# EAGLE design power_ldo (EAGLE 9.0.1)
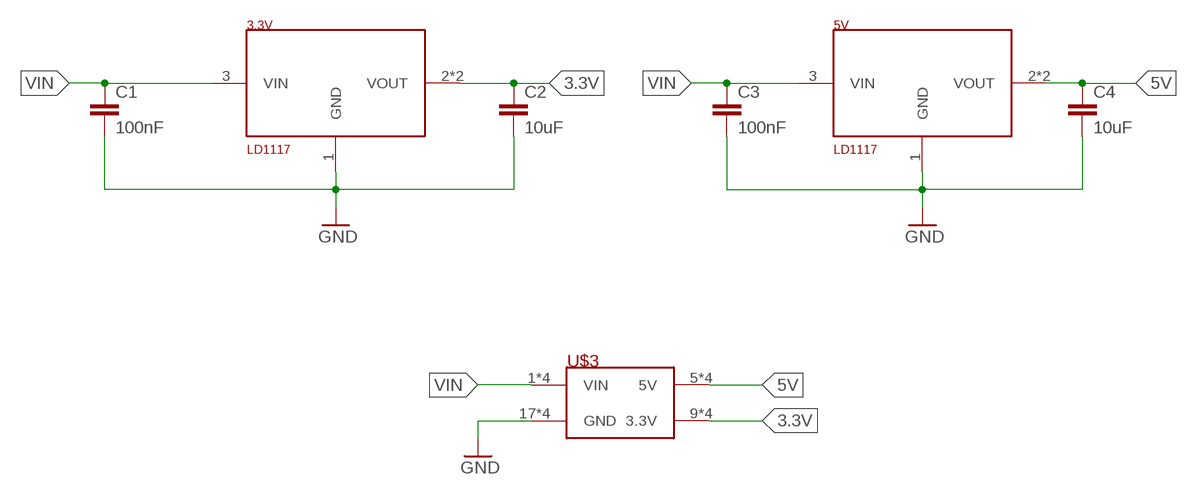
[diagram p0: schematic, sheet 1]

## Parts
3.3V  LD1117"  [SOT223]
5V  LD1117"  [SOT223]
C1  100nF  C-EUC0603  [C0603]
C2  10uF  C-EUC0603  [C0603]
C3  100nF  C-EUC0603  [C0603]
C4  10uF  C-EUC0603  [C0603]
U$3  POWER_EDGE_CONNEDGE  [20-PIN-CARD-EDGE]

## Nets
3.3V: 3.3V.2(VOUT) 3.3V.4(VOUT) C2.1 U$3.9(3.3V) U$3.10(3.3V) U$3.11(3.3V) U$3.12(3.3V)
5V: 5V.2(VOUT) 5V.4(VOUT) C4.1 U$3.5(5V) U$3.6(5V) U$3.7(5V) U$3.8(5V)
GND: 3.3V.1(GND) 5V.1(GND) C1.2 C2.2 C3.2 C4.2 U$3.17(GND) U$3.18(GND) U$3.19(GND) U$3.20(GND)
VIN: 3.3V.3(VIN) 5V.3(VIN) C1.1 C3.1 U$3.1(VIN) U$3.2(VIN) U$3.3(VIN) U$3.4(VIN)

## Library data of the parts
3.3V 5V = auv:LD1117
C1-C4 = auv:C-EU: CAPACITOR, European symbol
U$3 = auv:POWER_EDGE_CONN

## Board
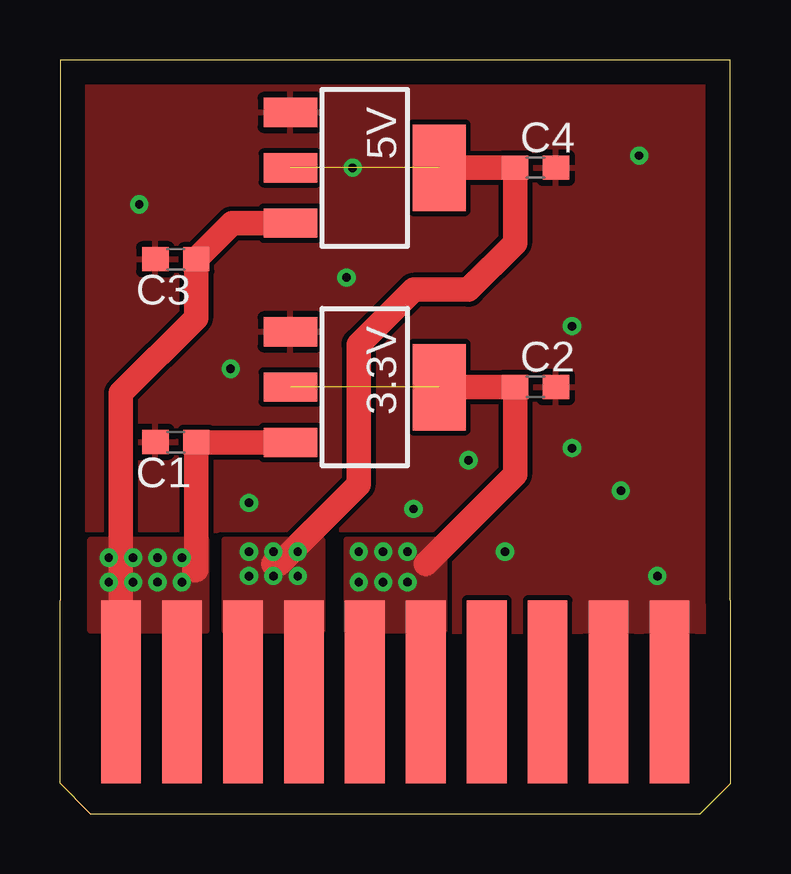
[diagram p1: board, top side]
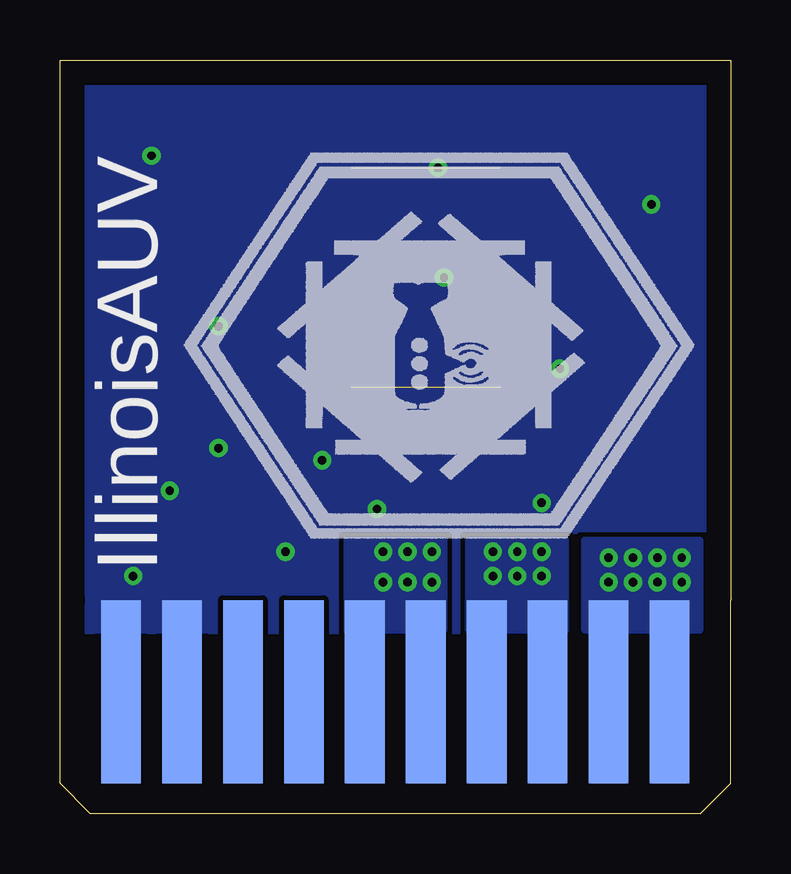
[diagram p2: board, bottom side, seen from below]

Size 27.94 x 31.42 mm. Coordinates in mm from the lower left corner, seen from the top.
Outline: 27.92,8.89 27.92,31.42 0,31.42 0,8.89
Copper layers (1*16): Top 0.035mm / dielectric 1.5mm / Bottom 0.035mm
Design rules "PCBway": minimum track width 6mil, minimum drill 0.3mm, track to track 0.205mm, track to pad 0.205mm, pad to pad 0.205mm, via to via 0.205mm, smd to smd 8mil, copper to edge 40mil, drill to drill 8mil, minimum pad ring 10mil, minimum via ring 8mil, stop-mask expansion 4mil, vias tented up to drill 25mil, thermal gap 10mil

### Footprints (pad centres in the part's own frame; a part is rotated, then mirrored left to right if it is on the bottom)
SOT223 = smd 1.219 x 2.235: 1 -2.311,-3.099; 2 0,-3.099; 3 2.311,-3.099 | smd 3.6 x 2.2: 4 0,3.099
C0603 = smd 1.1 x 1: 1 -0.85,0; 2 0.85,0
20-PIN-CARD-EDGE = smd 1.651 x 7.62: 1 -11.43,-1.27; 3 -8.89,-1.27; 5 -6.35,-1.27; 7 -3.81,-1.27; 9 -1.27,-1.27; 11 1.27,-1.27; 13 3.81,-1.27; 15 6.35,-1.27; 17 8.89,-1.27; 19 11.43,-1.27 | smd 1.651 x 7.62 bottom: 2 -11.43,-1.27; 4 -8.89,-1.27; 6 -6.35,-1.27; 8 -3.81,-1.27; 10 -1.27,-1.27; 12 1.27,-1.27; 14 3.81,-1.27; 16 6.35,-1.27; 18 8.89,-1.27; 20 11.43,-1.27

### Placement (x,y rotation side)
3.3V  12.7,17.78 270 top
5V  12.7,26.92 270 top
C1  4.83,15.49 180 top
C2  19.81,17.78 0 top
C3  4.83,23.11 180 top
C4  19.81,26.92 0 top
U$1  [ILLINOISAUV]  13.72,18.54 270 bottom
U$3  13.97,6.35 0 top

### Tracks (layer width: path | path; a pad name or v marks a point on that pad's centre or on a via)
3.3V  (via drill 0.35)  (1 unrouted)
  Top 1.016: 3.3V.4 C2.1 18.96,14.14 15.24,10.41
  other vias: 12.45,10.92 13.46,10.92 14.48,10.92 12.45,9.65 13.46,9.65 14.48,9.65
  pour Top (no thermals): 16,11.43 16,7.62 11.94,7.62 11.94,11.43
  pour Bottom (no thermals): 11.94,11.43 11.94,7.62 16,7.62 16,11.43
5V  (via drill 0.35)  (1 unrouted)
  Top 1.016: 8.89,10.41 9.14,10.41 12.45,13.72 12.45,19.56 14.73,21.84 17.02,21.84 18.96,23.79 C4.1 5V.4
  other vias: 7.87,10.92 8.89,10.92 9.91,10.92 9.91,9.91 8.89,9.91 7.87,9.91
  pour Top (no thermals): 10.92,11.43 10.92,7.62 6.86,7.62 6.86,11.43
  pour Bottom (no thermals): 6.86,11.43 6.86,7.62 10.92,7.62 10.92,11.43
GND  (via drill 0.35)
  other vias: 23.37,13.46 24.89,9.91 21.34,20.32 7.11,18.54 3.3,25.4 11.94,22.35 24.13,27.43 12.19,26.92 7.87,12.95 14.73,12.7 17.02,14.73 21.34,15.24 18.54,10.92
  pour Top (rank 6): 0,31.75 0,7.62 27.94,7.62 27.94,31.75
  pour Top (no thermals): 26.67,11.43 26.67,7.62 21.84,7.62 21.84,11.43
  pour Bottom (rank 6): 27.94,31.75 27.94,7.62 0,7.62 0,31.75
  pour Bottom (no thermals): 21.84,11.43 21.84,7.62 26.67,7.62 26.67,11.43
VIN  (via drill 0.35)
  Top 1.016: 5.59,10.16 5.68,10.16 C1.1 5.68,15.47 3.3V.3 | 2.54,8.13 2.54,17.53 5.68,20.66 C3.1 7.17,24.61 5V.3
  other vias: 2.03,10.67 3.05,10.67 4.06,10.67 5.08,10.67 2.03,9.65 3.05,9.65 4.06,9.65 5.08,9.65
  pour Top (no thermals): 6.1,11.43 6.1,7.62 1.27,7.62 1.27,11.43
  pour Bottom (no thermals): 1.27,11.43 1.27,7.62 6.1,7.62 6.1,11.43